# EAGLE board main_controller (EAGLE 9.6.2)
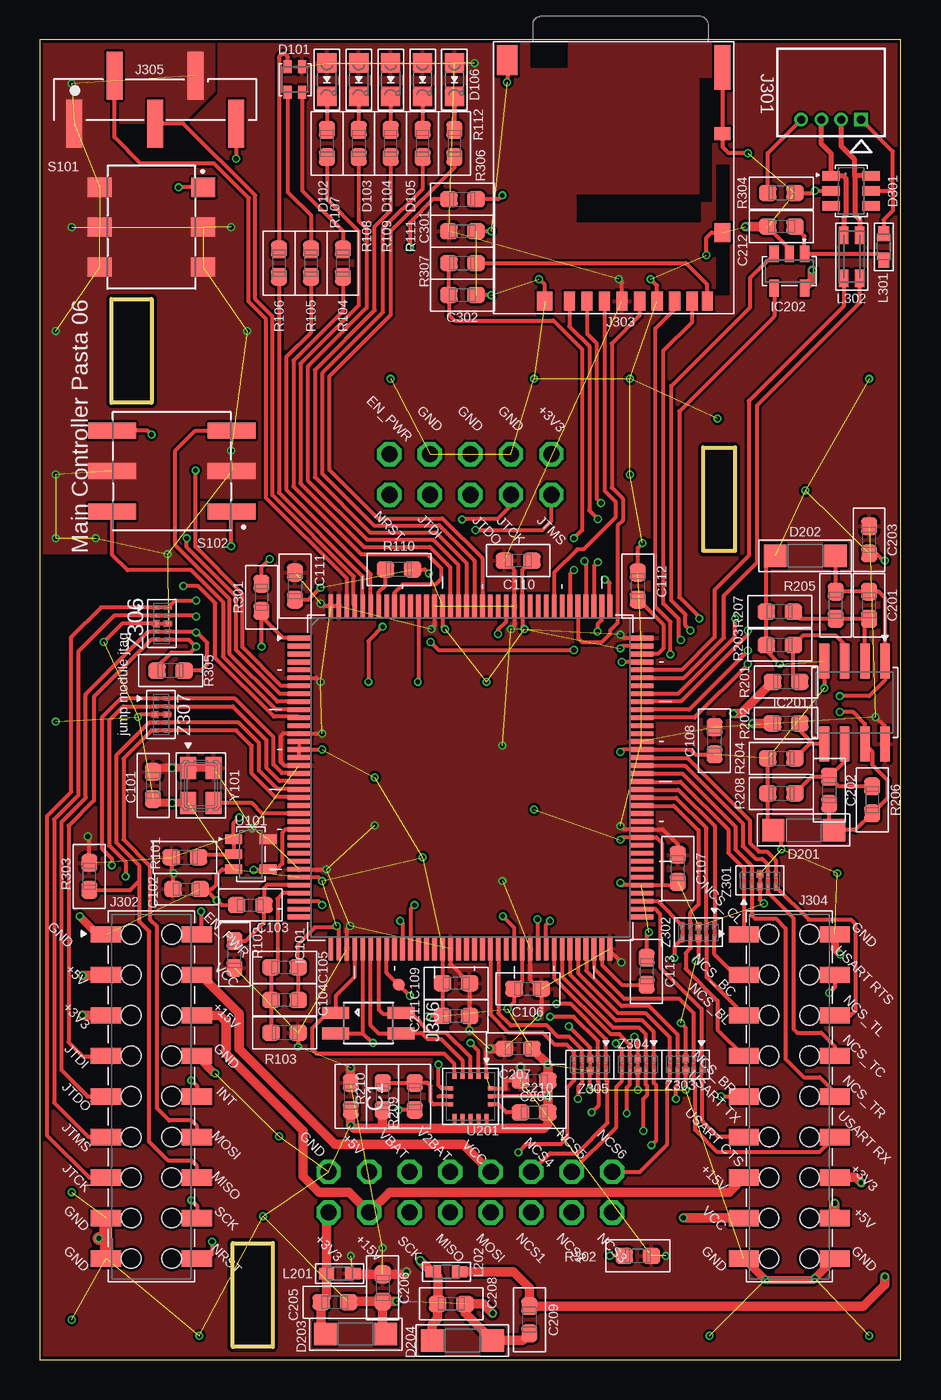
[diagram p3: board, top side]
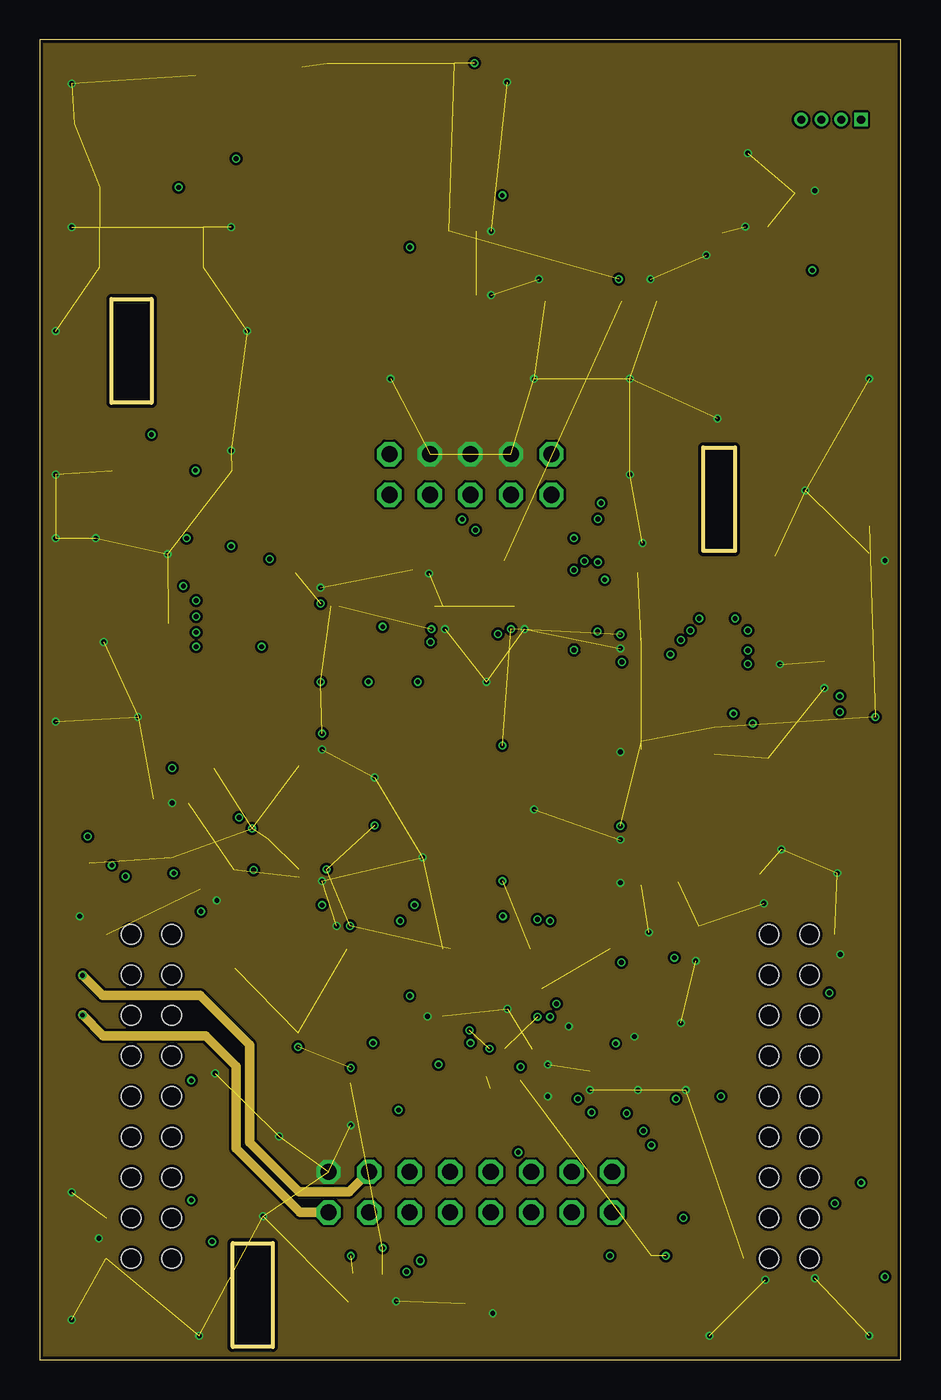
[diagram p4: board, inner layer Route2]
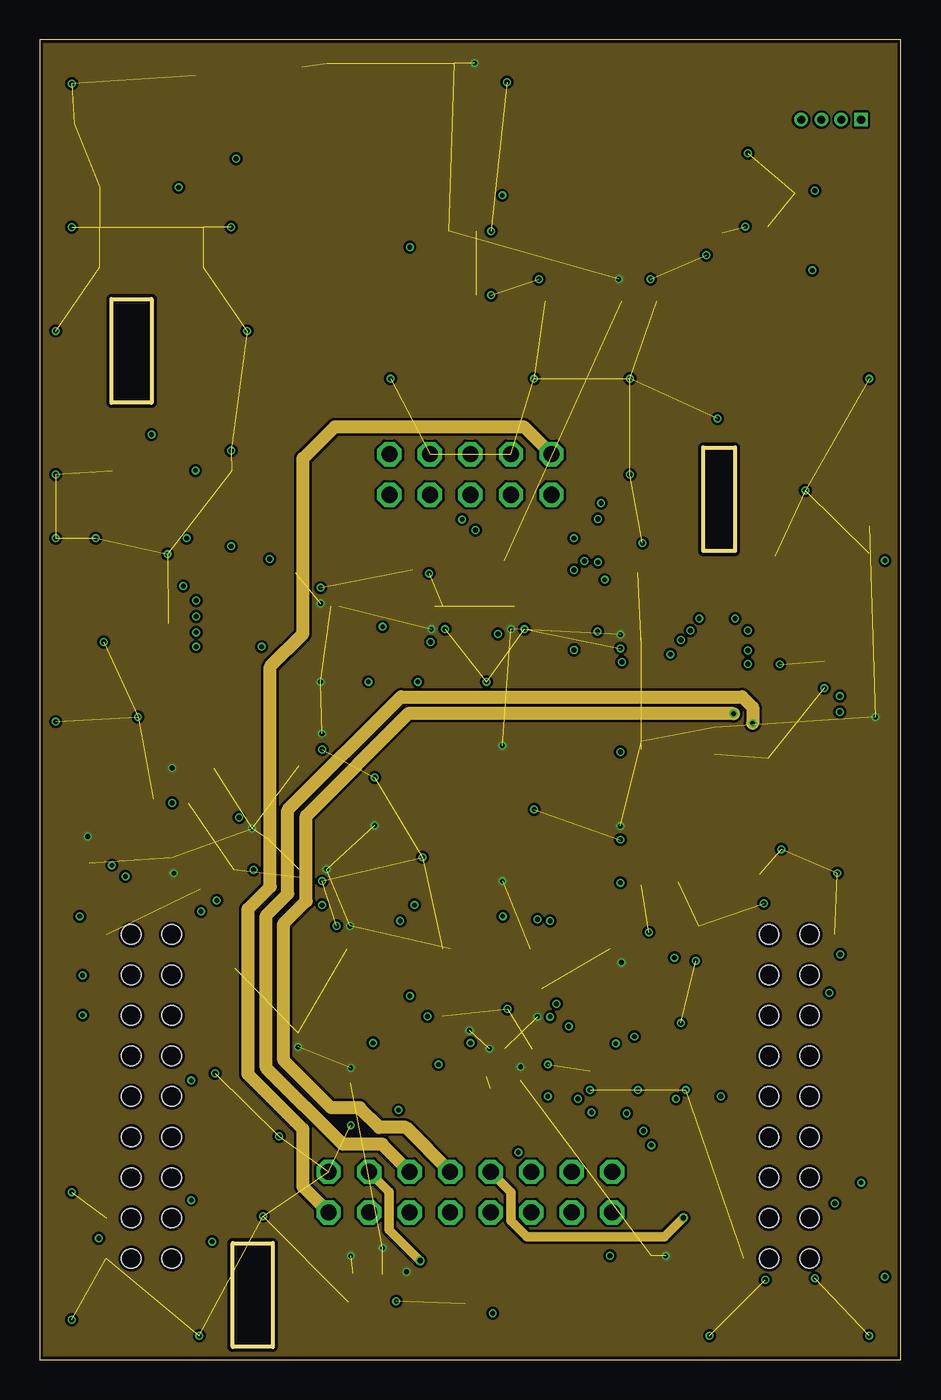
[diagram p5: board, inner layer Route15]
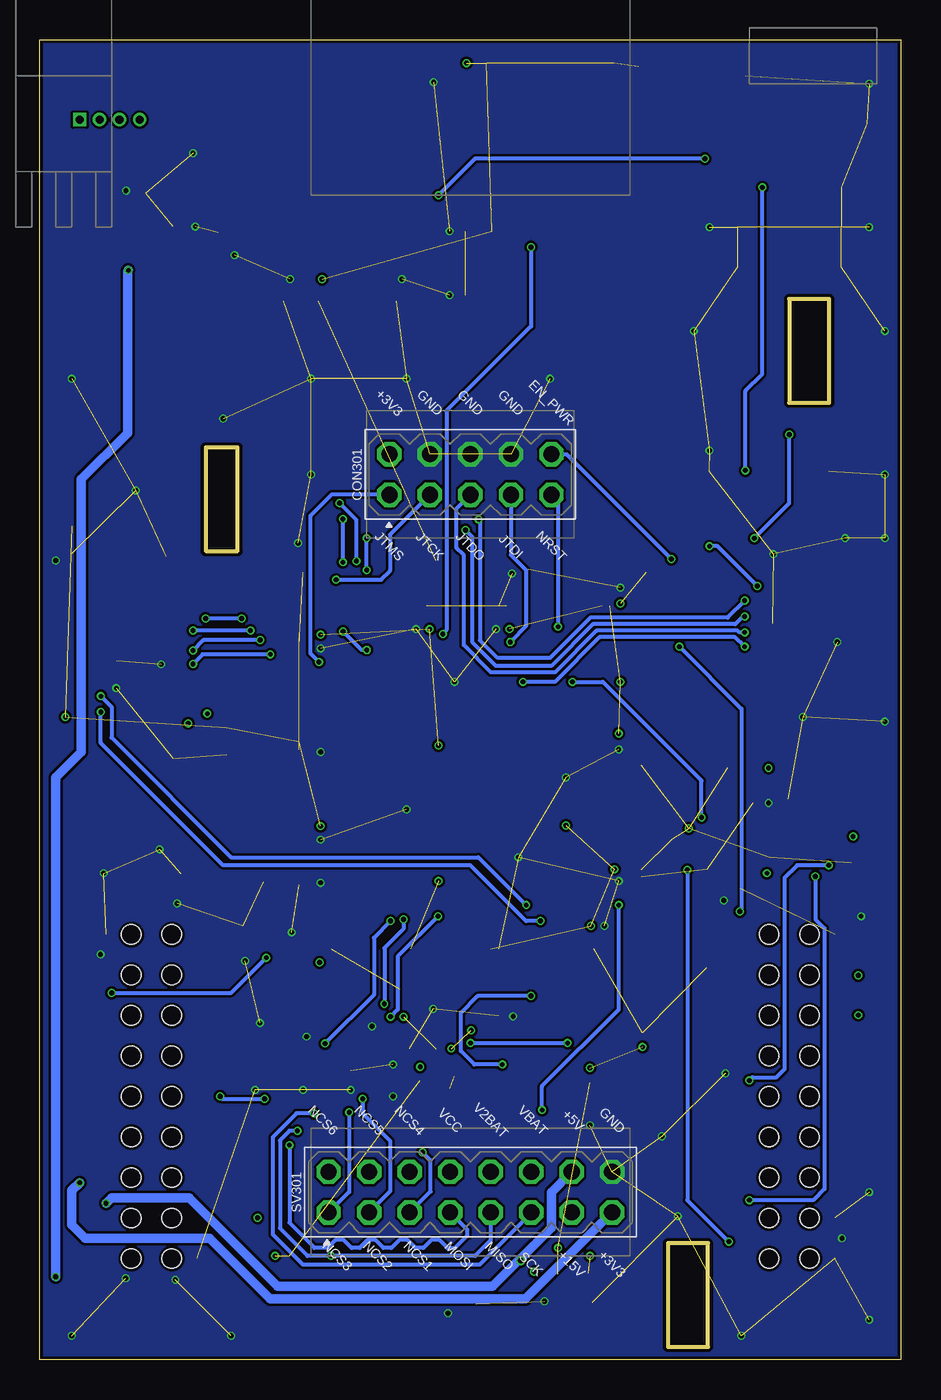
[diagram p6: board, bottom side, seen from below]

Size 54 x 82.75 mm. Coordinates in mm from the lower left corner, seen from the top.
Outline: 0,82.75 0,0 54,0 54,82.75 0,82.75
Copper layers (1+2*15+16): Top 0.035mm / dielectric 0.175mm / Route2 0.035mm / dielectric 1.13mm / Route15 0.035mm / dielectric 0.175mm / Bottom 0.035mm
Design rules "35u Robotics DRU No. 3 (6mil, 4 Layer, 0.3mm Drill)": minimum track width 6mil, minimum drill 0.3mm, track to track 6mil, track to pad 6mil, pad to pad 6mil, via to via 6mil, smd to smd 0mil, copper to edge 0.2mm, drill to drill 6mil, minimum pad ring 0.1mm, minimum via ring 0.1mm, stop-mask expansion 0.05mm, vias tented up to drill 0.45mm, thermal gap 0.2mm
Net classes: 0 default: width 0.254 mm, drill 0.3 mm, clearance 0.1 mm

## Footprints (pad centres in the part's own frame; a part is rotated, then mirrored left to right if it is on the bottom)
PAD.03X.03 = smd 0.762 x 0.762: P$1 0,0
C0603 = smd 1.1 x 1: 1 -0.85,0; 2 0.85,0
MA05-2 = drill 1.016 octagon: 1 -5.08,-1.27; 2 -5.08,1.27; 3 -2.54,-1.27; 4 -2.54,1.27; 5 0,-1.27; 6 0,1.27; 7 2.54,-1.27; 8 2.54,1.27; 9 5.08,-1.27; 10 5.08,1.27
WL-SFCX_0606 = smd 0.8 x 0.5: 1 0.8,0.45; 2 0.8,-0.45; 3 -0.8,-0.45; 4 -0.8,0.45
CHIPLED_0805 = smd 1.2 x 1.2: A 0,-1.05; C 0,1.05
SOD123 = smd 1.4 x 1.4: A 1.9,0; C -1.9,0
WE-TVS_SOT23-6L = smd 1.1 x 0.6: 1 -1.25,0.95; 2 -1.25,0; 3 -1.25,-0.95; 4 1.25,-0.95; 5 1.25,0; 6 1.25,0.95
QFP50P2200X2200X160-144N = smd 1.475 x 0.3: 1 -10.738,8.75; 2 -10.738,8.25; 3 -10.738,7.75; 4 -10.738,7.25; 5 -10.738,6.75; 6 -10.738,6.25; 7 -10.738,5.75; 8 -10.738,5.25; 9 -10.738,4.75; 10 -10.738,4.25; 11 -10.738,3.75; 12 -10.738,3.25; 13 -10.738,2.75; 14 -10.738,2.25; 15 -10.738,1.75; 16 -10.738,1.25; 17 -10.738,0.75; 18 -10.738,0.25; 19 -10.738,-0.25; 20 -10.738,-0.75; 21 -10.738,-1.25; 22 -10.738,-1.75; 23 -10.738,-2.25; 24 -10.738,-2.75; 25 -10.738,-3.25; 26 -10.738,-3.75; 27 -10.738,-4.25; 28 -10.738,-4.75; 29 -10.738,-5.25; 30 -10.738,-5.75; 31 -10.738,-6.25; 32 -10.738,-6.75; 33 -10.738,-7.25; 34 -10.738,-7.75; 35 -10.738,-8.25; 36 -10.738,-8.75; 73 10.738,-8.75; 74 10.738,-8.25; 75 10.738,-7.75; 76 10.738,-7.25; 77 10.738,-6.75; 78 10.738,-6.25; 79 10.738,-5.75; 80 10.738,-5.25; 81 10.738,-4.75; 82 10.738,-4.25; 83 10.738,-3.75; 84 10.738,-3.25; 85 10.738,-2.75; 86 10.738,-2.25; 87 10.738,-1.75; 88 10.738,-1.25; 89 10.738,-0.75; 90 10.738,-0.25; 91 10.738,0.25; 92 10.738,0.75; 93 10.738,1.25; 94 10.738,1.75; 95 10.738,2.25; 96 10.738,2.75; 97 10.738,3.25; 98 10.738,3.75; 99 10.738,4.25; 100 10.738,4.75; 101 10.738,5.25; 102 10.738,5.75; 103 10.738,6.25; 104 10.738,6.75; 105 10.738,7.25; 106 10.738,7.75; 107 10.738,8.25; 108 10.738,8.75 | smd 0.3 x 1.475: 37 -8.75,-10.738; 38 -8.25,-10.738; 39 -7.75,-10.738; 40 -7.25,-10.738; 41 -6.75,-10.738; 42 -6.25,-10.738; 43 -5.75,-10.738; 44 -5.25,-10.738; 45 -4.75,-10.738; 46 -4.25,-10.738; 47 -3.75,-10.738; 48 -3.25,-10.738; 49 -2.75,-10.738; 50 -2.25,-10.738; 51 -1.75,-10.738; 52 -1.25,-10.738; 53 -0.75,-10.738; 54 -0.25,-10.738; 55 0.25,-10.738; 56 0.75,-10.738; 57 1.25,-10.738; 58 1.75,-10.738; 59 2.25,-10.738; 60 2.75,-10.738; 61 3.25,-10.738; 62 3.75,-10.738; 63 4.25,-10.738; 64 4.75,-10.738; 65 5.25,-10.738; 66 5.75,-10.738; 67 6.25,-10.738; 68 6.75,-10.738; 69 7.25,-10.738; 70 7.75,-10.738; 71 8.25,-10.738; 72 8.75,-10.738; 109 8.75,10.738; 110 8.25,10.738; 111 7.75,10.738; 112 7.25,10.738; 113 6.75,10.738; 114 6.25,10.738; 115 5.75,10.738; 116 5.25,10.738; 117 4.75,10.738; 118 4.25,10.738; 119 3.75,10.738; 120 3.25,10.738; 121 2.75,10.738; 122 2.25,10.738; 123 1.75,10.738; 124 1.25,10.738; 125 0.75,10.738; 126 0.25,10.738; 127 -0.25,10.738; 128 -0.75,10.738; 129 -1.25,10.738; 130 -1.75,10.738; 131 -2.25,10.738; 132 -2.75,10.738; 133 -3.25,10.738; 134 -3.75,10.738; 135 -4.25,10.738; 136 -4.75,10.738; 137 -5.25,10.738; 138 -5.75,10.738; 139 -6.25,10.738; 140 -6.75,10.738; 141 -7.25,10.738; 142 -7.75,10.738; 143 -8.25,10.738; 144 -8.75,10.738
SO08 = smd 0.6 x 2.2: 1 -1.905,-2.6; 2 -0.635,-2.6; 3 0.635,-2.6; 4 1.905,-2.6; 5 1.905,2.6; 6 0.635,2.6; 7 -0.635,2.6; 8 -1.905,2.6
SOT23-5:1 = smd 0.59 x 1.059: 1 -0.95,-1.078; 2 0,-1.078; 3 0.95,-1.078; 4 0.95,1.078; 5 -0.95,1.078
CON_530480410_MOL = drill 0.508 pad 0.838 square: 1 0,0 | drill 0.508 pad 0.838: 2 1.245,0; 3 2.489,0; 4 3.759,0
610X1821821 = smd 1.02 x 1.9: 1 -10.16,-2.85; 2 -10.16,2.85; 3 -7.62,-2.85; 4 -7.62,2.85; 5 -5.08,-2.85; 6 -5.08,2.85; 7 -2.54,-2.85; 8 -2.54,2.85; 9 0,-2.85; 10 0,2.85; 11 2.54,-2.85; 12 2.54,2.85; 13 5.08,-2.85; 14 5.08,2.85; 15 7.62,-2.85; 16 7.62,2.85; 17 10.16,-2.85; 18 10.16,2.85 | hole 1.2: -10.16,-1.27; -7.62,-1.27; -7.62,1.27; -10.16,1.27; -5.08,-1.27; -5.08,1.27; -2.54,1.27; -2.54,-1.27; 0,-1.27; 0,1.27; 2.54,-1.27; 2.54,1.27; 5.08,1.27; 5.08,-1.27; 7.62,1.27; 7.62,-1.27; 10.16,-1.27; 10.16,1.27
DM3AT-SF-PEJM5 = smd 0.7 x 1.2: 1 3.2,-0.1; 2 2.1,-0.1; 3 1,-0.1; 4 -0.1,-0.1; 5 -1.2,-0.1; 6 -2.3,-0.1; 7 -3.4,-0.1; 8 -4.5,-0.1; B -5.45,-0.1 | smd 1 x 0.8: A -6.4,-10.6 | smd 1 x 1.2: MOUNT0 4.75,-0.1; MOUNT1 -6.4,-4.4 | smd 1 x 2.8: MOUNT2 -6.4,-14.75 | smd 1.3 x 1.9: MOUNT3 7.1,-15.2
61000618221 = smd 1 x 3: 1 -6.35,-1.5; 2 -3.81,1.5; 3 -1.27,-1.5; 4 1.27,1.5; 5 3.81,-1.5
623X0421021 = smd 0.74 x 1.7: 1 -0.635,-2.05; 2 -0.635,2.05; 3 0.635,-2.05; 4 0.635,2.05
WE-CBF_0603(W=2.6) = smd 0.95 x 0.7: 1 -0.825,0; 2 0.825,0
WE-CNSW_1206 = smd 1.1 x 0.6: 1 -1.35,0.5; 2 1.35,0.5; 3 1.35,-0.5; 4 -1.35,-0.5
R0603 = smd 1.1 x 1: 1 -0.85,0; 2 0.85,0
452403012014 = smd 1.2 x 1.5: 1 -2.5,3.25; 2 0,3.25; 3 2.5,3.25; 4 -2.5,-3.25; 5 0,-3.25; 6 2.5,-3.25
428542320816 = smd 3 x 1: 1 -3.75,2.54; 2 3.75,-2.54; 4 -3.75,-2.54; 8 3.75,2.54; C1 -3.75,0; C2 3.75,0
MA08-2 = drill 1.016 octagon: 1 -8.89,-1.27; 2 -8.89,1.27; 3 -6.35,-1.27; 4 -6.35,1.27; 5 -3.81,-1.27; 6 -3.81,1.27; 7 -1.27,-1.27; 8 -1.27,1.27; 9 1.27,-1.27; 10 1.27,1.27; 11 3.81,-1.27; 12 3.81,1.27; 13 6.35,-1.27; 14 6.35,1.27; 15 8.89,-1.27; 16 8.89,1.27
SOT23-5 = smd 1.059 x 0.59: 1 -1.078,0.95; 2 -1.078,0; 3 -1.078,-0.95; 4 1.078,-0.95; 5 1.078,0.95
ICM20609 = smd 0.35 x 0.25: P1 -1.265,1; P2 -1.265,0.5; P3 -1.265,0; P4 -1.265,-0.5; P5 -1.265,-1; P9 1.265,-1; P10 1.265,-0.5; P11 1.265,0; P12 1.265,0.5; P13 1.265,1 | smd 0.25 x 0.35: P6 -0.5,-1.265; P7 0,-1.265; P8 0.5,-1.265; P14 0.5,1.265; P15 0,1.265; P16 -0.5,1.265
830207192009 = smd 1.4 x 1: P1 -1.1,-0.8; P2 1.1,-0.8; P3 1.1,0.8; P4 -1.1,0.8
UDFN10 = smd 0.25 x 0.25: 1 1,0.4; 2 0.5,0.4; 4 -0.5,0.4; 5 -1,0.4; 6 -1,-0.4; 7 -0.5,-0.4; 9 0.5,-0.4; 10 1,-0.4 | smd 0.35 x 0.35: 3 0,0.4; 8 0,-0.4

## Placement (x,y rotation side)
301  TEST-POINT3  [PAD.03X.03]  22.5,23.5 0 top
C1  100n ±10% 50V X7R  [C0603]  19.5,16.5 270 top
C101  100n ±10% 50V X7R  [C0603]  7.1,36 270 top
C102  100n ±10% 50V X7R  [C0603]  9.2,29.5 0 top
C103  470n ±10% 25V X7R  [C0603]  13.2,28.5 180 top
C104  1u ±10% 25V X7R  [C0603]  15.35,22.55 0 top
C105  100n ±10% 50V X7R  [C0603]  15.35,24.6 0 top
C106  100n ±10% 50V X7R  [C0603]  30.6,23.25 180 top
C107  100n ±10% 50V X7R  [C0603]  40,30.8 270 top
C108  100n ±10% 50V X7R  [C0603]  42.3,38.8 270 top
C109  100n ±10% 50V X7R  [C0603]  26.1,23.6 180 top
C110  100n ±10% 50V X7R  [C0603]  30,50.1 0 top
C111  4u7 ±20% 6V3 X5R  [C0603]  16,48.5 270 top
C112  2u2 ±20% 6V3 X5R  [C0603]  37.5,48.5 90 top
C113  2u2 ±20% 6V3 X5R  [C0603]  38.05,24.35 90 top
C201  22p ±5% 50V NP0  [C0603]  52,47.3 270 top
C202  22p ±5% 50V NP0  [C0603]  49.5,35.7 90 top
C203  100n ±10% 50V X7R  [C0603]  52,51.4 270 top
C204  100n ±10% 50V X7R  [C0603]  31,17.5 0 top
C205  4u7 ±20% 6V3 X5R  [C0603]  18.5,3.6 0 top
C206  10u ±20% 6V3 X5R  [C0603]  21.5,4.5 270 top
C207  2u2 ±20% 6V3 X5R  [C0603]  30,19.5 0 top
C208  4u7 ±20% 6V3 X5R  [C0603]  25.8,3.5 0 top
C209  10u ±20% 6V3 X5R  [C0603]  30.7,2.5 270 top
C210  470n ±10% 25V X7R  [C0603]  31,15.5 0 top
C211  10n ±10% 50V X7R  [C0603]  26.1,21.55 180 top
C212  4u7 ±20% 6V3 X5R  [C0603]  46.5,71.05 180 top
C301  100n ±10% 50V X7R  [C0603]  26.5,70.75 0 top
C302  100n ±10% 50V X7R  [C0603]  26.5,66.75 0 top
CON301  power-dist.  [MA05-2]  27,55.5 0 bottom
D101  [WL-SFCX_0606]  16,80.26 270 top
D102  red  [CHIPLED_0805]  18,80.25 180 top
D103  yellow  [CHIPLED_0805]  20,80.25 180 top
D104  blue  [CHIPLED_0805]  22,80.25 180 top
D105  red  [CHIPLED_0805]  24,80.25 180 top
D106  yellow  [CHIPLED_0805]  26,80.25 180 top
D201  PTVS3V3S1UR  [SOD123]  47.9,33.2 180 top
D202  PTVS3V3S1UR  [SOD123]  48,50.4 180 top
D203  PTVS3V3S1UR  [SOD123]  19.8,1.6 0 top
D204  PTVS5V0S1UR  [SOD123]  26.5,1.2 0 top
D301  [WE-TVS_SOT23-6L]  50.88,73.28 0 top
IC101  STM32F429ZIT6  [QFP50P2200X2200X160-144N]  27,36.5 0 top
IC201  OPA2333SO08  [SO08]  51.1,41.2 180 top
IC202  STMPS2151STR  [SOT23-5:1]  47,68.25 180 top
J301  530480410  [CON_530480410_MOL]  51.5,77.75 180 top
J302  [610X1821821]  7,16.5 270 top
J303  DM3AT-SF-PEJM5  [DM3AT-SF-PEJM5]  36.41,66.27 180 top
J304  [610X1821821]  47,16.5 270 top
J305  [61000618221]  8.5,79 0 top
J306  [623X0421021]  20.6,21.1 270 top
L201  2700Z  [WE-CBF_0603(W=2.6)]  18.8,5.4 180 top
L202  2700Z  [WE-CBF_0603(W=2.6)]  25.5,5.5 180 top
L301  742861210  [WE-CBF_0603(W=2.6)]  52.92,69.77 90 top
L302  [WE-CNSW_1206]  50.91,69.15 270 top
R101  1k ±1% 75V 0.1W  [R0603]  9.1,31.5 180 top
R102  4R7 ±1% 75V 0.1W  [R0603]  12.2,25.4 90 top
R103  4R7 ±1% 75V 0.1W  [R0603]  15.35,20.5 180 top
R104  1k ±1% 75V 0.1W  [R0603]  19,68.75 90 top
R105  1k ±1% 75V 0.1W  [R0603]  17,68.75 90 top
R106  1k ±1% 75V 0.1W  [R0603]  15,68.75 90 top
R107  1k ±1% 75V 0.1W  [R0603]  18,76.25 90 top
R108  1k ±1% 75V 0.1W  [R0603]  20,76.25 90 top
R109  1k ±1% 75V 0.1W  [R0603]  22,76.25 90 top
R110  10k ±1% 75V 0.1W  [R0603]  22.52,49.55 0 top
R111  1k ±1% 75V 0.1W  [R0603]  24,76.25 90 top
R112  1k ±1% 75V 0.1W  [R0603]  26,76.25 90 top
R201  8M2 ±1% 75V 0.1W  [R0603]  46.8,42.5 180 top
R202  8M2 ±1% 75V 0.1W  [R0603]  46.8,39.9 180 top
R203  390k ±1% 75V 0.1W  [R0603]  46.4,44.8 0 top
R204  820k ±1% 75V 0.1W  [R0603]  46.5,37.7 0 top
R205  470k ±1% 75V 0.1W  [R0603]  49.9,47.3 90 top
R206  470k ±1% 75V 0.1W  [R0603]  52.2,35.1 270 top
R207  470k ±1% 75V 0.1W  [R0603]  46.4,46.9 0 top
R208  470k ±1% 75V 0.1W  [R0603]  46.5,35.5 0 top
R209  0R ±1% 75V 0.1W  [R0603]  23.5,16.5 270 top
R210  0R ±1% 75V 0.1W  [R0603]  21.5,16.5 90 top
R301  1k ±1% 75V 0.1W  [R0603]  13.9,47.8 270 top
R302  1k ±1% 75V 0.1W  [R0603]  37.5,6.5 0 top
R303  1k ±1% 75V 0.1W  [R0603]  3.1,30.3 90 top
R304  1k ±1% 75V 0.1W  [R0603]  46.5,73.15 180 top
R305  0R ±1% 75V 0.1W  [R0603]  8.2,43.2 0 top
R306  1k ±1% 75V 0.1W  [R0603]  26.5,72.75 180 top
R307  1k ±1% 75V 0.1W  [R0603]  26.5,68.75 180 top
S101  [452403012014]  7,71 270 top
S102  [428542320816]  8.28,55.7 180 top
SV301  [MA08-2]  27,10.5 0 bottom
U101  SN74AHC1G125DBVR  [SOT23-5]  13.24,31.69 0 top
U201  ICM20609  [ICM20609]  27,16.5 270 top
U$1  [POWER_DISTRIBUTION_BOARD_TOP]  27,16.5 270 top
Y101  8 MHz  [830207192009]  10.1,36 270 top
Z301  ESD8704  [UDFN10]  45.15,30.05 180 top
Z302  ESD8704  [UDFN10]  41.3,26.8 0 top
Z303  ESD8704  [UDFN10]  40.5,18.5 0 top
Z304  ESD8704  [UDFN10]  37.5,18.5 0 top
Z305  ESD8704  [UDFN10]  34.5,18.5 0 top
Z306  ESD8704  [UDFN10]  7.65,46.15 90 top
Z307  ESD8704  [UDFN10]  7.6,40.45 90 top

## Tracks (layer width: path | path; a pad name or v marks a point on that pad's centre or on a via)
+3V3  (via drill 0.3)  (43 unrouted)
  Top 0.254: v17.7,39.25 IC101.13 15.25,39.25 15.1,39.1 15.1,37.5 15.35,37.25 IC101.17 | IC101.30 v17.97,30.75 | IC201.8 53,39.7 v52.4,40.3 | IC101.108 36.67,45.25 36.6,45.25 v36.4,45.45 | IC101.39 19.25,26.93 19.25,27 v19.45,27.2 | IC101.72 35.75,25.62 v36.47,24.9 | v36.4,33.45 36.6,33.25 36.67,33.25 IC101.84 39.06,33.25 40,32.31 C107.1 | v29.55,45.8 29.75,46 29.75,46.07 IC101.121 29.75,49.5 C110.1 | IC101.131 24.75,46.07 24.75,46 v24.55,45.8 | IC101.143 IC101.144 17.76,47.24 v17.6,47.4 | IC101.6 17.35,42.75 v17.6,42.5 | J303.4 36.51,67.54 v36.3,67.75 | IC101.52 25.75,24.8 C109.1 C211.1 v26.95,20.65 | IC101.62 30.75,23.85 31.35,23.25 C106.1 31.45,21.75 v31.2,21.5 | R303.2 3.1,32.7 v3,32.8 | R101.2 8.25,30.65 8.35,30.55 | 8.35,30.55 v8.4,30.5 | C102.1 8.35,30.55 | R103.1 v16.2,19.6 | U201.P16 29.2,17 29.2,17.5 C204.1 | U201.P1 28,19.3 v28.2,19.5
  Top 0.508: Y101.P4 Y101.P1 | Y101.P1 v8.3,37.1 | Y101.P1 7.35,37.1 C101.1
  Top 0.61: L201.1 19.68,5.35 C206.1 22.85,5.35 v23,5.5 | C207.1 v28.2,19.5 | C204.1 v30.15,18.35 | C1.1 v19.5,18.3
  other vias: 13.3,33.3 27.25,81.3 19.5,6.5 21.5,7 29,38.5 29,30 21,33.5 39.25,6.5
  pour Top (rank 2): 54.4,83.15 54.4,-0.6 -0.5,-0.6 -0.5,83.15
  pour Route15 (no thermals): 55.3,87.7 -1.6,87.7 -1.6,-1.4 55.3,-1.4
  pour Top (no thermals): 12.1,35.7 14.3,33.5 15.2,33.5 15.2,30.7 14,30.7 13.1,31.6 10.8,31.6 10.8,35.3
+3V3_  (via drill 0.3)
  Top 0.61: D203.C 17.65,1.85 C205.1 17.98,3.93 L201.2 17.98,9.09 SV301.15 | J304.14 51.18,11.42 v51.5,11.1 | v2.68,21.6 2.7,21.58 J302.5
  Route2 0.61: SV301.15 16.31,9.23 12.3,13.24 12.3,18.4 10.4,20.3 3.98,20.3 v2.68,21.6
  Route15 0.813: SV301.15 16.5,10.84 16.5,14.45 13.05,17.9 13.05,28.25 14.45,29.65 14.45,43.45 16.5,45.5 16.5,56.5 18.5,58.5 30.35,58.5 CON301.2
  Bottom 0.61: SV301.15 23.54,3.8 39.55,3.8 43.35,7.6 51.15,7.6 52,8.45 52,10.6 v51.5,11.1
+5V  (via drill 0.3)
  Top 0.61: L202.1 29.71,5.5 30.7,4.51 C209.1 51.65,3.35 53,4.7 v53,5.2 | IC202.5 48.45,67.67 v48.45,68.3
  Bottom 0.61: v53,5.2 53,36.5 51.4,38.1 51.4,55.2 48.5,58.1 48.5,68.25 v48.45,68.3
+5V_  (via drill 0.3, 0.35)
  Top 0.61: v2.68,24.1 4.13,24.1 J302.3 | v49.85,9.8 J304.16 | v23.85,6.2 24.55,5.5 L202.2 24.98,5.2 24.98,3.53 C208.1 24.95,2.55 24.6,2.2 D204.C
  Route2 0.61: SV301.14 19.4,10.52 16.25,10.52 13.15,13.62 13.15,19.75 10.05,22.85 3.93,22.85 v2.68,24.1
  Route15 0.61: SV301.14 21.9,10.52 21.9,8.15 v23.85,6.2
  Bottom 0.61: SV301.14 21.92,10.5 21.92,8.28 25.6,4.6 39.1,4.6 44.65,10.15 49.5,10.15 v49.85,9.8
+15V
  Top 0.61: J304.13 43.23,10.5 21.92,10.5 SV301.13 19.38,10.5 17.5,10.5 16.5,11.5 16.5,14.36 11.69,19.16 11.69,21.16 11.28,21.58 J302.6
+15V_  (via drill 0.3)
  Top 0.61: v44.7,39.9 R202.2
  Route15 0.813: v44.7,39.9 44.7,40.9 44.05,41.55 22.65,41.55 15.55,34.45 15.55,29.2 14.2,27.85 14.2,18.3 19,13.5 21.46,13.5 SV301.12
A
  cutout Top: 25,18.5 29,18.5 29,14.5 25,14.5
BMI_FSYNC  (via drill 0.3)
  Top 0.254: IC101.34 17.45,28.75 v17.7,28.5 | R209.2 v22.5,15.65
  Bottom 0.254: v17.7,28.5 17.7,21.95 22.5,17.15 v22.5,15.65
BOOT0
  Top 0.254: IC101.138 21.25,48.13 21.67,48.55 R110.1
DEBUG_RX
  Top 0.254: IC101.141 19.68,47.31 19.68,49.11 14.59,54.2 14.59,65.41 13.5,66.5 13.5,73 9,77.5 J305.3
DEBUG_TX
  Top 0.254: IC101.142 19.25,48.96 14.19,54.03 14.19,65.24 13.09,66.33 13.09,72.83 10.93,75 6.34,75 4.69,76.65 J305.2
EN_PWR  (via drill 0.3)
  Top 0.254: IC101.1 15.25,45.25 13.9,46.6 R301.2 v13.9,44.7 | v10.1,28.1 10.1,26.91 J302.2
  Bottom 0.254: v13.9,44.7 10,40.8 10,28.2 v10.1,28.1
GND  (via drill 0.3)  (86 unrouted)
  Top 0.254: R204.1 R208.1 45.65,33.55 D201.A 46.5,32.7 v46.5,32 | D202.A 45.55,49.85 R207.1 R203.1 45.55,44.45 v46.4,43.6 | IC201.4 v49.2,42.11 v49.2,42.1 | v36.4,38.1 36.55,38.25 IC101.94 40.8,38.25 41.1,37.95 C108.2 | v36.4,32.6 36.55,32.75 IC101.83 38.65,32.75 39,32.4 39,29.75 | IC101.38 18.75,27.05 18.7,27.1 | 18.7,27.1 v18.6,27.2 | IC101.15 v17.7,38.25 | IC101.14 IC101.15 | IC101.16 IC101.15 | IC101.130 25.25,45.95 v25.4,45.8 | v30.4,45.8 30.25,45.95 IC101.120 30.25,49.5 C110.2 | IC101.107 36.55,44.75 v36.4,44.6 | R110.2 24.15,49.55 v24.4,49.3 | IC101.31 17.45,30.25 v17.7,30 | C203.2 52.45,50.55 52.9,50.1 v53,50.1 | J303.MOUNT2 J303.A 42.81,76.04 43.2,75.65 v44.4,75.65 | J303.6 38.71,67.34 v38.3,67.75 | J303.MOUNT0 31.66,67.39 v31.3,67.75 | C112.2 37.5,50.9 v37.8,51.2 | C104.2 C105.2 16.2,26.05 17.25,27.1 18.7,27.1 | v36.4,29.9 36.55,29.75 IC101.77 39,29.75 | 39,29.75 40,29.75 C107.2 | IC101.51 C109.2 C211.2 24.35,21.55 v24.32,21.52 | IC101.61 30.25,23.75 C106.2 29.73,23.23 29.73,22.4 v29.33,22 | C111.2 16.85,47.65 v17.6,48.4 | C103.2 11.4,28.5 v11.1,28.8 10.4,29.5 C102.2 10.8,29.5 11.1,29.8 11.1,30.4 11.44,30.74 U101.3 | v38.2,26.8 38.05,26.65 C113.2 | Z301.8 Z301.3 45.15,28.85 v45.4,28.6 | v41.13,25 41.3,25.17 Z302.8 Z302.3 | Z306.8 Z306.3 5.15,46.15 v4,45 | Z307.8 Z307.3 6.3,40.45 v6.15,40.3 | R304.1 48.45,73.15 v48.6,73.3 48.6,73.28 D301.2 | v41.8,69.25 41.8,70.35 42.12,70.67 J303.MOUNT1 | IC202.2 47,69.65 45.65,71 C212.2 | J303.MOUNT3 v29.31,80.11 v29.3,80.1 | C301.2 v28.3,70.75 | v28.3,66.75 C302.2 | U201.P13 28,14.5 | U201.P12 27.5,14.5 | U201.P11 27,14.5 | U201.P10 26.5,14.5 | U201.P9 26,14.5 | v37.5,16.9 Z304.8 Z304.3 37.5,20.03 v37.28,20.25
  Top 0.254: v34.5,16.9 Z305.8 Z305.3 34.5,19.57 v33.17,20.9 | v31.85,16.5 U201.P15 | v40.5,16.9 Z303.8 Z303.3 40.5,20.8 v40.2,21.1
  Top 0.508: v8.3,34.9 Y101.P2 7.35,34.9 C101.2 | J304.18 v48.61,5.1 48.51,5 v45.5,5 J304.17 | J304.2 49.85,25.75 v50.2,25.4 | J302.8 10.94,17.95 v11,17.95 | J302.1 3.64,26.66 v2.5,27.8
  Top 0.61: C206.2 21.5,1.8 D203.A | C205.2 19.4,3.65 C206.2 | C206.2 v22.35,3.65 | C209.2 30.25,1.2 D204.A 26.65,2.95 C208.2 27.8,3.5 v28.4,2.9 | C212.2 v44.25,71.05 | C1.2 v19.5,14.7 19.7,14.5 21.5,14.5 | C207.2 v31.85,18.5 C204.2 v31.85,16.5 C210.2 31.85,14.75 31.6,14.5 28,14.5 27.5,14.5 27,14.5 26.5,14.5 26,14.5 21.5,14.5 | R210.1 21.5,14.5
  Top 0.813: v3.7,7.6 4.15,7.6 | 4.15,7.6 J302.15 | 4.15,7.6 J302.17
  other vias: 1,55.5 12,57 2,71 12,71 2,80 8,50.5 1,51.5 3.5,51.5 13,64.5 1,64.5 22,61.5 31,61.5 37,61.5 37,55.5 42.5,59 48,54.5 52,61.5 31,34.5 21,36.5 28,42.5 24,31.5 50,30.5 42,1.5 52,1.5 10,1.5 2,2.5 2,10.5 15,14 14,9 1,40
  pour Route2 (no thermals): 54.9,87.3 -1.1,87.3 -1.1,-1 54.9,-1
  pour Bottom (no thermals): 55.67,88.1 -2.1,88.1 -2.1,-1.8 55.67,-1.78
  pour Top (no thermals): 11,75 13,73 13,66.5 14,65.5 14,54 10,54 10,49.5 5.5,49.5 4.5,50.5 0,50.5 0,82.75 11,82.75 11,79.5 9,77.5 4.5,77.5 4.5,76.5 6,75
HEARTBEAT_BLUE
  Top 0.254: IC101.140 20.25,49.11 15,54.36 R106.1
HEARTBEAT_GREEN
  Top 0.254: IC101.139 20.75,49.26 15.45,54.56 15.45,62.85 17,64.4 R105.1
HEARTBEAT_RED
  Top 0.254: IC101.136 22.25,48.09 22.76,48.6 24.8,48.6 25.19,48.99 25.19,49.59 24.27,50.5 20.15,50.5 15.9,54.75 15.9,62.65 19,65.75 R104.1
ID_1  (via drill 0.3)
  Top 0.254: v12,51 12,53.13 S102.1 | IC101.11 16.19,40.32 14.68,40.32 11,44 11,47.42 9.93,48.5 v9,48.5
  Bottom 0.254: v9,48.5 11.5,51 v12,51
ID_2  (via drill 0.3)
  Top 0.254: IC101.8 15.05,41.75 12.3,44.5 12.3,47.85 9.2,50.95 v9.2,51.5 | v7,58 6.76,58.24 S102.2
  Bottom 0.254: v9.2,51.5 7,53.7 v7,58
ID_3
  Top 0.254: IC101.9 14.9,41.25 11.89,44.26 11.89,47.68 8.5,51.08 8.5,57 9.74,58.24 S102.4
ID_4
  Top 0.254: IC101.10 14.82,40.75 11.49,44.09 11.49,47.51 9.5,49.5 5.5,49.5 4.54,50.46 S102.8
ID_5  (via drill 0.3)
  Top 0.254: S101.1 v8.7,73.5 | IC101.7 15.12,42.25 12.71,44.67 12.71,48.02 9.75,50.97 v9.75,55.75
  Bottom 0.254: v9.75,55.75 9.75,60.75 8.7,61.8 v8.7,73.5
IMU_INT  (via drill 0.3)
  Top 0.254: U201.P6 25.2,17 25,17.2 v25,18.5 | IC101.44 21.75,24.25 301.P$1 v23.2,22.8
  Bottom 0.254: v23.2,22.8 26.55,22.8 27.6,21.75 27.6,19.35 26.75,18.5 v25,18.5
IMU_MISO
  Top 0.254: U201.P4 26.5,18.77 25.18,20.09 24.33,20.09 23.96,20.46 J306.4 21.23,20.46 20.75,20.95 IC101.42
IMU_MOSI
  Top 0.254: IC101.43 21.25,21.97 21.56,21.66 22.57,21.66 J306.2 23.27,21.73 24.5,20.5 25.47,20.5 27,18.97 U201.P3
IMU_NCS
  Top 0.254: IC101.40 19.75,24 18.55,22.8 J306.1 18.04,21.73 17.1,20.8 17.1,19.45 17.34,19.2 25.35,19.2 26,18.55 U201.P5
IMU_P7
  Top 0.254: U201.P7 25,16.5
IMU_SCK  (via drill 0.3)
  Top 0.254: IC101.41 20.25,20.46 | J306.3 20.25,20.46 | v27,19.85 27.5,19.35 U201.P2 | v20.9,19.85 20.87,19.85 20.25,20.46
  Bottom 0.254: v27,19.85 v20.9,19.85
JTCK  (via drill 0.3)
  Top 0.254: IC101.109 35.73,47.26 35.73,48.71 35.54,48.9 v35.42,48.9 | J302.13 3.08,11.42 0.44,14.06 0.44,34.06 1.97,35.59 1.97,45.3 3.83,47.17 7.23,47.17 Z306.1 Z306.10 8.5,47.6 v9.8,47.6 | v26.48,52.69 26.5,52.7 28.7,52.7 29.54,53.54 CON301.3
  Bottom 0.254: v9.8,47.6 10.88,46.52 19.48,46.52 22,44 25.3,44 26.4,45.1 26.4,52.6 v26.48,52.69 | v35.42,48.9 32.6,48.9 32.04,49.46 32.04,51.73 CON301.3
JTDI_MAINBUS  (via drill 0.3)
  Top 0.254: IC101.110 35.23,47.22 35.23,46.36 34.98,46.12 v34.98,45.65 | v24.5,45 25,44.5 v33.5,44.5
  Bottom 0.254: CON301.7 24.46,50.46 23.5,49.5 23.5,46 v24.5,45 | v33.5,44.5 33.83,44.5 v34.98,45.65
JTDI_MODULEBUS  (via drill 0.3)
  Top 0.254: J302.7 4.11,19 2.7,19 1.8,19.9 1.8,33.47 3.38,35.05 3.38,41.56 6.97,45.15 Z306.5 Z306.6 9.33,45.15 9.78,44.7 v9.8,44.7 9.45,44.35 8.25,44.35 7.35,43.45 R305.1 | IC101.133 23.75,42.55 v23.7,42.5
  Bottom 0.254: v9.8,44.7 10.4,45.3 18.9,45.3 21.7,42.5 v23.7,42.5
JTDO_MAINBUS  (via drill 0.3)
  Top 0.254: J302.9 3,16.5 1.35,18.15 1.35,33.69 2.88,35.22 2.88,41.73 6.8,45.65 Z306.7 | R305.2 10.1,43.2 10.5,43.6 10.5,44.95 9.85,45.6 v9.8,45.6 9.75,45.65 Z306.7 | Z306.7 | Z306.4 Z306.7
  Bottom 0.254: v9.8,45.6 10.12,45.6 10.23,45.71 19.09,45.71 21.71,43.09 25.71,43.09 27.42,44.8 27.42,50.44 27.87,50.89 27.87,53.36 CON301.5
JTMS  (via drill 0.3)
  Top 0.254: IC101.105 v36.5,43.75 | J302.11 3.04,13.96 0.89,16.11 0.89,33.88 2.42,35.41 2.42,44.42 4.66,46.65 7,46.65 | v27.31,52.01 31.51,52.01 32.08,52.58 CON301.1 | 7.5,46.65 9.75,46.65 v9.8,46.6 | 7.5,46.65 7,46.65 | Z306.9 7,46.65 | Z306.9 7.5,46.65 | Z306.2 Z306.9
  Bottom 0.254: v9.8,46.6 9.9,46.6 10.39,46.11 19.31,46.11 21.93,43.5 25.4,43.5 26.9,45 26.9,51.6 v27.31,52.01 | CON301.1 35.72,54.23 37.05,52.9 37.05,44.3 v36.5,43.75
LED_1
  Top 0.254: IC101.128 26.25,49.81 24.65,51.41 20.52,51.41 16.8,55.13 16.8,62.25 20.5,65.95 20.5,70.9 20,71.4 R108.1
LED_2
  Top 0.254: IC101.127 26.75,49.95 24.84,51.86 20.71,51.86 17.25,55.32 17.25,62.05 21,65.8 21,71.05 22,72.05 R109.1
LED_3
  Top 0.254: R111.1 24,73.4 21.5,70.9 21.5,65.65 17.7,61.85 17.7,55.55 20.95,52.3 25.05,52.3 27.25,50.1 IC101.126
LED_4
  Top 0.254: R112.1 26,74.75 22,70.75 22,65.5 18.15,61.65 18.15,55.8 21.2,52.75 25.25,52.75 27.75,50.25 IC101.125
LED_ERROR
  Top 0.254: IC101.129 25.75,49.67 24.46,50.95 20.34,50.95 16.35,54.94 16.35,62.45 20,66.1 20,70.75 18,72.75 R107.1
MAINBUS_MISO  (via drill 0.3)
  Top 0.254: IC101.66 32.75,24.02 35.97,20.81 37.59,20.81 38,20.4 Z304.2 Z304.9 38,17.25 38.1,17.15 38.1,16.6 37.85,16.35 v37.85,14.35 | R302.1 v35.75,6.5
  Bottom 0.254: SV301.9 25.73,7.47 26.7,6.5 v35.75,6.5 | v37.85,14.35 38.34,14.35 38.95,13.74 38.95,8.24 37.21,6.5 v35.75,6.5 | v35.75,6.5
MAINBUS_MOSI  (via drill 0.3)
  Top 0.254: IC101.67 33.25,24.15 36.14,21.26 37.79,21.26 38.5,20.55 Z304.1 Z304.10 38.5,17.35 38.65,17.2 38.65,13.75 v38.35,13.45
  Bottom 0.254: v38.35,13.45 v38.35,13.44 38.35,8.58 36.77,7.01 35.94,7.01 35.45,7.5 34.95,7.5 34.45,7 33.95,7 33.45,7.5 32.95,7.5 32.45,7 31.95,7 31.45,7.5 30.95,7.5 30.45,7 29.95,7 29.45,7.5 28.95,7.5 28.45,7 27.95,7 27.2,7.75 27.2,8.16 SV301.7
MAINBUS_NCS1  (via drill 0.3)
  Top 0.254: IC101.57 28.25,21.65 29.4,20.5 31.55,20.5 32.3,19.75 33.05,19.75 33.5,19.3 Z305.5 Z305.6 33.5,17.5 33.05,17.05 33.05,13.9 32.65,13.5 30.5,13.5 v30,13
  Bottom 0.254: SV301.5 29.5,10.54 29.5,12.5 v30,13
MAINBUS_NCS2  (via drill 0.3)
  Top 0.254: IC101.58 28.75,21.73 29.53,20.95 31.8,20.95 32.5,20.25 33.2,20.25 34,19.45 Z305.4 Z305.7 34,17.35 33.75,17.1 v33.75,16.35
  Bottom 0.254: SV301.3 32.01,10.57 32.01,13.7 33.75,15.44 v33.75,16.35
MAINBUS_NCS3  (via drill 0.3)
  Top 0.254: IC101.60 29.75,27.08 v29.03,27.8 | v32,21.5 33.47,21.5 35,19.97 Z305.2 Z305.9 35,17.45 35.05,17.4 35.05,15.95 v34.6,15.5
  Bottom 0.254: v34.6,15.5 34.6,10.52 SV301.1 | v29.03,27.8 31.55,25.28 31.55,21.95 v32,21.5
MAINBUS_NCS4  (via drill 0.3)
  Top 0.254: IC101.63 31.25,27.55 v31.2,27.6 | v32.4,22.3 33.3,22.3 35.5,20.09 Z305.1 Z305.10 35.5,17.55 35.6,17.45 35.6,14.85 33.7,12.95 31.99,12.95 SV301.6
  Bottom 0.254: v31.2,27.6 31.2,27 32.4,25.8 v32.4,22.3
MAINBUS_NCS5  (via drill 0.3)
  Top 0.254: IC101.64 31.75,27.25 v32,27.5 | SV301.4 36.15,14.57 36.15,17.1 36.5,17.45 Z304.6 Z304.5 36.5,19.43 v36.12,19.82
  Bottom 0.254: v32,27.5 33.05,26.45 33.05,22.88 v36.12,19.82
MAINBUS_NCS6
  Top 0.254: IC101.68 33.75,24.26 36.29,21.71 38,21.71 39.5,20.21 Z303.5 Z303.6 39.5,17.5 39.35,17.35 39.35,13.5 37.62,11.77 SV301.2
MAINBUS_SCK  (via drill 0.3)
  Top 0.254: IC101.65 32.25,23.95 35.8,20.4 36.35,20.4 37,19.75 Z304.4 Z304.7 37,17.25 36.8,17.05 v36.8,15.45
  Bottom 0.254: v36.8,15.45 37.9,15.45 39.4,13.95 39.4,7.85 37.5,5.95 26.42,5.95 23.19,9.18 SV301.11
MODULE_INT  (via drill 0.3)
  Top 0.254: IC101.18 16.24,36.77 15.19,36.77 14.65,37.31 14.65,39.04 12.24,41.45 Z307.10 Z307.1 5.08,41.45 3.88,40.25 3.88,32.05 4.52,31.41 v4.52,31 | v9.5,17.5 9.85,17.15 J302.10
  Bottom 0.254: v4.52,31 6.5,31 7.3,30.2 7.3,18.2 7.8,17.7 9.3,17.7 v9.5,17.5
MODULE_MISO
  Top 0.254: IC101.20 16.24,35.77 14.9,35.77 13.74,36.94 13.74,38.67 12.46,39.95 Z307.7 | Z307.7 | Z307.7 6.86,39.95 4.79,37.88 4.79,32.42 6.22,31 6.22,30 | Z307.4 Z307.7 | J302.14 9.85,12.15 9.5,12.5 8,12.5 6.86,13.64 6.86,26.84 6.22,27.48 6.22,30 | R303.1 5.67,29.45 6.22,30
MODULE_MOSI
  Top 0.254: IC101.21 16.24,35.27 14.76,35.27 13.28,36.75 13.28,38.48 12.31,39.45 Z307.6 Z307.5 7.01,39.45 5.25,37.69 5.25,32.61 6.89,30.97 6.89,27.61 7.34,27.16 7.34,15.76 8.1,15 9.5,15 9.85,14.65 J302.12
MODULE_NCS_BL
  Top 0.254: IC101.87 37.76,34.73 39.76,34.73 41.3,33.19 41.3,28.54 40.8,28.04 Z302.4 Z302.7 40.8,25.8 40.5,25.5 40.5,24.5 42.5,22.5 42.5,20.69 J304.7
MODULE_NCS_CC
  Top 0.254: IC101.90 37.76,36.23 40.18,36.23 43.17,33.24 43.17,31.78 44.15,30.8 Z301.10 Z301.1 J304.1
MODULE_NCS_CL
  Top 0.254: IC101.89 37.76,35.73 40.04,35.73 42.32,33.45 42.32,27.22 Z302.1 Z302.10 42.3,25.4 43.58,24.12 J304.3
MODULE_NCS_CR
  Top 0.254: IC101.92 40.44,37.25 44.08,33.62 44.08,32.21 44.89,31.4 45.3,31.4 45.65,31.05 Z301.7 Z301.4 | J304.8 49.85,19.65 49,20.5 47.5,20.5 47.26,20.74 47.26,27.68 45.65,29.29 45.65,29.5 | Z301.4 45.65,29.5 | 45.65,29.5 Z301.4 | Z301.7 Z301.4
MODULE_NCS_FL
  Top 0.254: IC101.88 37.76,35.23 39.9,35.23 41.8,33.32 Z302.2 Z302.9 41.8,24 44.15,21.65 J304.5
MODULE_NCS_FR
  Top 0.254: IC101.93 37.76,37.73 40.61,37.73 44.53,33.8 44.53,32.39 45.07,31.85 45.59,31.85 46.15,31.29 Z301.6 Z301.5 48.21,27.59 50.84,27.59 51.13,27.3 51.13,21.88 50.83,21.58 J304.6
MODULE_NCS_TR
  Top 0.254: J304.10 49.85,16.75 48.9,17.7 47.9,17.7 46.75,18.85 46.75,27.05 46.15,27.65 44.85,27.65 44.65,27.85 44.65,29.5 | IC101.91 40.3,36.75 43.62,33.43 43.62,31.98 44.65,30.95 44.65,30 | Z301.2 44.65,29.5 | 44.65,29.5 Z301.9 44.65,30 | Z301.2 | Z301.2 44.65,30
MODULE_SCK  (via drill 0.3)
  Top 0.254: IC101.19 16.24,36.27 15.04,36.27 14.19,37.12 14.19,38.86 12.1,40.95 Z307.9 | v5.37,30.3 5.37,31.21 4.34,32.24 4.34,40.06 5.23,40.95 Z307.2 | v9.5,10 9.85,9.65 J302.16 | Z307.2 | Z307.9 | Z307.9 Z307.2
  Bottom 0.254: v5.37,30.3 5.37,27.61 4.8,27.04 4.8,10.7 5.5,10 v9.5,10
N$1
  Top 0.254: R201.1 47.25,42.9 R203.2 47.85,45.4 49.9,45.4 50.47,44.84 IC201.3
N$2
  Top 0.254: IC201.2 51.73,46.19 C201.2 R205.1 47.7,46.45 R207.2
N$3
  Top 0.254: R208.2 48.4,36.55 C202.2 | IC201.6 50.47,37.52 C202.2 | R206.1 50.1,35.95 C202.2
N$4
  Top 0.254: R204.2 48.25,38.6 48.5,38.6 | IC201.5 48.5,38.6 | R202.1 47.65,39.45 48.5,38.6
N$5
  Top 0.254: R210.2 R209.1 24.3,17.35 24.5,17.15 24.5,16.2 24.7,16 U201.P8
N$6  (via drill 0.3)
  Top 0.254: R301.1 13.9,49.7 v14.4,50.2
  Bottom 0.254: CON301.10 20.97,56.77 v14.4,50.2
N$7
  Top 0.254: D102.C R107.2
N$8
  Top 0.254: C210.1 29.25,15.5 28.75,16 U201.P14
N$9
  Top 0.254: D103.C R108.2
N$10
  Top 0.254: D104.C R109.2
N$12
  Top 0.254: R104.2 19,70.75 16.45,73.3 D101.1
N$13
  Top 0.254: R105.2 17,71.75 15.55,73.2 D101.2
N$14
  Top 0.254: D101.3 15.55,81.6 arc90 15.28,81.88 arc90 15,81.6 R106.2
N$15
  Top 0.305: L302.1 51.41,71.49 51.1,71.8 51.1,74.23 | D301.6 51.1,74.23 | 51.1,74.23 51.1,75.25 50.25,76.09 J301.2
N$16  (via drill 0.3)
  Top 0.254: J305.5 v12.31,75.31 v12.3,75.3 | v29,73 28.75,72.75 R306.1
  Bottom 0.254: v12.3,75.3 26.7,75.3 v29,73
N$17
  Top 0.254: R304.2 45.65,75.66 J301.4
N$18
  Top 0.305: L302.4 50.41,71.61 50.55,71.75 50.55,74.05 50.37,74.23 D301.1 49.63,75.62 49,76.25 49,77.74 J301.3
N$19
  Top 0.254: D301.5 53.5,73.28 | 53.5,73.28 53.5,72.05 52.92,71.47 L301.2 | J301.1 53.5,75.75 53.5,73.28
N$20
  Top 0.254: D105.C R111.2
N$21
  Top 0.254: D106.C R112.2
NRST  (via drill 0.3)
  Top 0.254: IC101.25 16.24,33.23 15.39,33.23 15.2,33.03 15.2,31.1 14.84,30.74 U101.4 14.28,30.7 v13.4,30.7 | v10.8,7.4 10.8,6.6 10.54,6.34 J302.18
  Bottom 0.254: v13.4,30.7 13.4,10 v10.8,7.4
NRST_  (via drill 0.3)
  Top 0.254: v12.5,34 12.16,33.66 U101.1 U101.2 10.14,31.69 R101.1 | v21.5,45.95 20.6,45.05 v20.6,42.5
  Bottom 0.254: v12.5,34 12.5,36.3 18.7,42.5 v20.6,42.5 | CON301.9 21.5,53.81 v21.5,45.95
OSC_IN
  Top 0.254: IC101.23 13.95,34.25 13.3,34.9 Y101.P3
SD_CARD_DETECT_GND
  Top 0.254: J303.B 41.86,67.39 40.5,68.75 R307.1
SD_CLK
  Top 0.254: IC101.113 33.75,45.25 34,45 35.25,45 35.75,45.5 35.75,45.72 36.23,46.2 36.23,52.28 36.55,52.61 36.55,53.99 35.86,54.68 35.86,63.71 37.61,65.46 J303.5
SD_CMD
  Top 0.254: J303.3 35.41,54.49 36.1,53.8 36.1,52.8 34.1,50.8 33.7,50.8 32.25,49.35 IC101.116
SD_DATA0  (via drill 0.3)
  Top 0.254: v39.55,44.22 v39.54,44.23 39.54,46.26 38.6,47.2 38.6,64.65 39.81,65.86 J303.7 | IC101.98 41.06,40.25 44.4,43.59 v44.4,43.62
  Bottom 0.254: v44.4,43.62 43.8,44.22 v39.55,44.22
SD_DATA1  (via drill 0.3)
  Top 0.254: v40.2,45.12 40.04,45.27 40.04,46.46 39.1,47.4 39.1,63.25 40.91,65.06 J303.8 | v44.4,44.47 44.34,44.4 44.34,44.37 40.72,40.75 IC101.99
  Bottom 0.254: v40.2,45.12 43.75,45.12 v44.4,44.47
SD_DATA2  (via drill 0.3)
  Top 0.254: IC101.111 34.77,47.26 34.77,49.77 v35,50 | J303.1 33.21,64.78 34.45,63.54 34.45,53.25 v35,52.7
  Bottom 0.254: v35,50 v35,52.7
SD_DATA3  (via drill 0.3)
  Top 0.254: v34.15,50.07 34.25,49.97 IC101.112 | J303.2 34.31,64.32 34.91,63.73 34.91,53.99 v35.2,53.7
  Bottom 0.254: v34.15,50.07 34.15,52.65 v35.2,53.7
SD_DETECT  (via drill 0.3)
  Top 0.254: v33.5,51.5 34,52 34,63.35 32.2,65.15 26,65.15 25.65,65.5 C302.1 R307.2 | v33.5,49.5 33.25,49.25 IC101.114
  Bottom 0.254: v33.5,49.5 v33.5,51.5
SD_EJECT  (via drill 0.3)
  Top 0.254: R306.2 24.65,72.75 23.2,71.3 v23.2,69.75 | v28.73,45.5 28.73,45.77 29.25,46.28 IC101.122
  Bottom 0.254: v23.2,69.75 23.2,64.8 28.5,59.5 28.5,45.73 v28.73,45.5
U_BAT_1  (via drill 0.3)
  Top 0.254: D202.C R205.2 C201.1 52.6,48.15 53,47.75 IC201.1 53,42.61 52,41.6 v50.17,41.6 | v23.5,28.5 23.25,28.25 IC101.47
  Bottom 0.254: v50.17,41.6 49.5,40.93 49.5,39 42,31.5 26.5,31.5 v23.5,28.5
U_BAT_2  (via drill 0.3)
  Top 0.254: C202.1 49.5,33.5 D201.C 51.15,33.2 R206.2 53.15,35.2 53.15,36.35 52.2,37.3 52.2,38.14 IC201.7 51.73,39.86 51,40.6 v50.17,40.6 | v22.6,27.5 22.75,27.35 IC101.46
  Bottom 0.254: v22.6,27.5 23.5,27.5 27,31 42.5,31 50.17,38.67 v50.17,40.6
USART3_CTS
  Top 0.254: J304.11 42.54,13.96 41.55,14.95 41.55,17.5 41.5,17.55 Z303.10 Z303.1 41.5,22 38.89,24.61 38.89,27.94 38.59,28.25 IC101.74
USART3_RTS  (via drill 0.3)
  Top 0.254: IC101.75 38.75,28.75 Z302.5 Z302.6 39.8,25.9 v39.8,25.2 | J304.4 49.85,23.35 v49.5,23
  Bottom 0.254: v49.5,23 42,23 v39.8,25.2
USART3_RX
  Top 0.254: J304.12 48.89,13 42.5,13 41.1,14.4 41.1,17.25 41,17.35 Z303.9 Z303.2 41,21.72 40.1,22.62 36.67,22.62 34.75,24.54 IC101.70
USART3_TX  (via drill 0.3)
  Top 0.254: IC101.69 34.27,25.74 34.27,24.38 36.48,22.17 38.18,22.17 40,20.35 Z303.4 Z303.7 40,17.25 39.9,17.15 v39.9,16.35 | v42.7,16.5 J304.9
  Bottom 0.254: v42.7,16.5 42.55,16.35 v39.9,16.35
USBOTG_DM
  Top 0.254: IC101.103 40.39,42.75 42.91,45.26 42.91,47.91 45,50 45,59.85 51.41,66.26 L302.2
USBOTG_DP
  Top 0.254: IC101.104 40.25,43.25 42.3,45.3 42.3,48.26 44.45,50.41 44.45,60.11 50.41,66.06 L302.3
USBOTG_EN_PWR  (via drill 0.3)
  Top 0.254: IC101.101 37.76,41.77 40.06,41.77 43.6,45.32 v43.6,46.47 | v41.35,46.47 41.35,46.55 40.1,47.8 40.1,59.45 46.05,65.4 IC202.4
  Bottom 0.254: v41.35,46.47 v43.6,46.47
USBOTG_OVRCRT  (via drill 0.3)
  Top 0.254: IC101.100 37.76,41.27 40.2,41.27 44.4,45.47 v44.4,45.72 | IC202.3 44.55,67.83 44.55,66 39.6,61.05 39.6,47.6 40.5,46.7 40.5,46.02 v40.8,45.72
  Bottom 0.254: v44.4,45.72 | v40.8,45.72 v44.4,45.72
USBOTG_VBUS
  Top 0.254: L301.1 52.54,69.33 IC202.1 47.95,70.45 C212.1
VCAP_1
  Top 0.254: IC101.71 35.25,24.75 36.5,23.5 C113.1
VCAP_2
  Top 0.254: C112.1 37.55,47.65 39.1,46.1 39.1,44.6 38.75,44.25 IC101.106
VCC  (via drill 0.3)
  Top 0.61: J304.15 40.37,8.88 v40.35,8.9 | J302.4 10.08,24.12 12.5,21.7 12.5,19.5 18.5,13.5 26.54,13.5 SV301.8
  Route15 0.61: v40.35,8.9 39.15,7.7 30.55,7.7 29.54,8.71 29.54,10.5 SV301.8
VDD_  (via drill 0.3)
  Top 0.61: R201.2 43.95,40.5 v43.5,40.5
  Route15 0.813: SV301.10 22.95,14.55 21.3,14.55 20.05,15.8 18.27,15.8 15.3,18.77 15.3,27.35 16.7,28.75 16.7,34.1 23.1,40.5 v43.5,40.5
VDDA
  Top 0.254: IC101.33 15.25,29.25 14.9,28.9 14.9,25 C105.1 C104.1 R103.2
VREF+
  Top 0.254: IC101.32 14.25,29.75 14.05,29.55 C103.1 14.05,27.4 12.9,26.25 R102.2

## Text on the board
tPlace: Main Controller Pasta 06 | EN_PWR | GND | GND | GND | +3V3 | NRST | JTDI | JTDO | JTCK | JTMS | jump module jtag | NCS_CL | GND | EN_PWR | GND | +5V | VCC | NCS_BC | USART RTS | NCS_BL | +3V3 | +15V | NCS_TL | JTDI | GND | NCS_TC | NCS_BR | JTDO | INT | USART TX | NCS_TR | JTMS | MOSI | GND | +5V | VBAT | V2BAT | NCS5 | NCS6 | USART CTS | USART RX | VCC | NCS4 | JTCK | +15V | +3V3 | MISO | GND | SCK | VCC | +5V | GND | NRST | +3V3 | +15V | SCK | MISO | MOSI | NCS1 | NCS2 | NCS3 | GND | GND
bPlace: EN_PWR | GND | GND | GND | +3V3 | NRST | JTDI | JTDO | JTCK | JTMS | GND | +5V | VBAT | V2BAT | VCC | NCS4 | NCS5 | NCS6 | +3V3 | +15V | SCK | MISO | MOSI | NCS1 | NCS2 | NCS3
Document: BMI im Mittelpunkt des Roboters: / Oben unten ist gleich aufgeteilt. / vorne entfernung 53,5mm +10mm. / Gesamtlänge ist 98mm. | vorne | Top: +3V3 / L2: Ground / L15: +3V3 / Bottom: Ground | hinten